# Altium schematic sheet 0208_TBT_0_MISC_GND.SchDoc
size A3
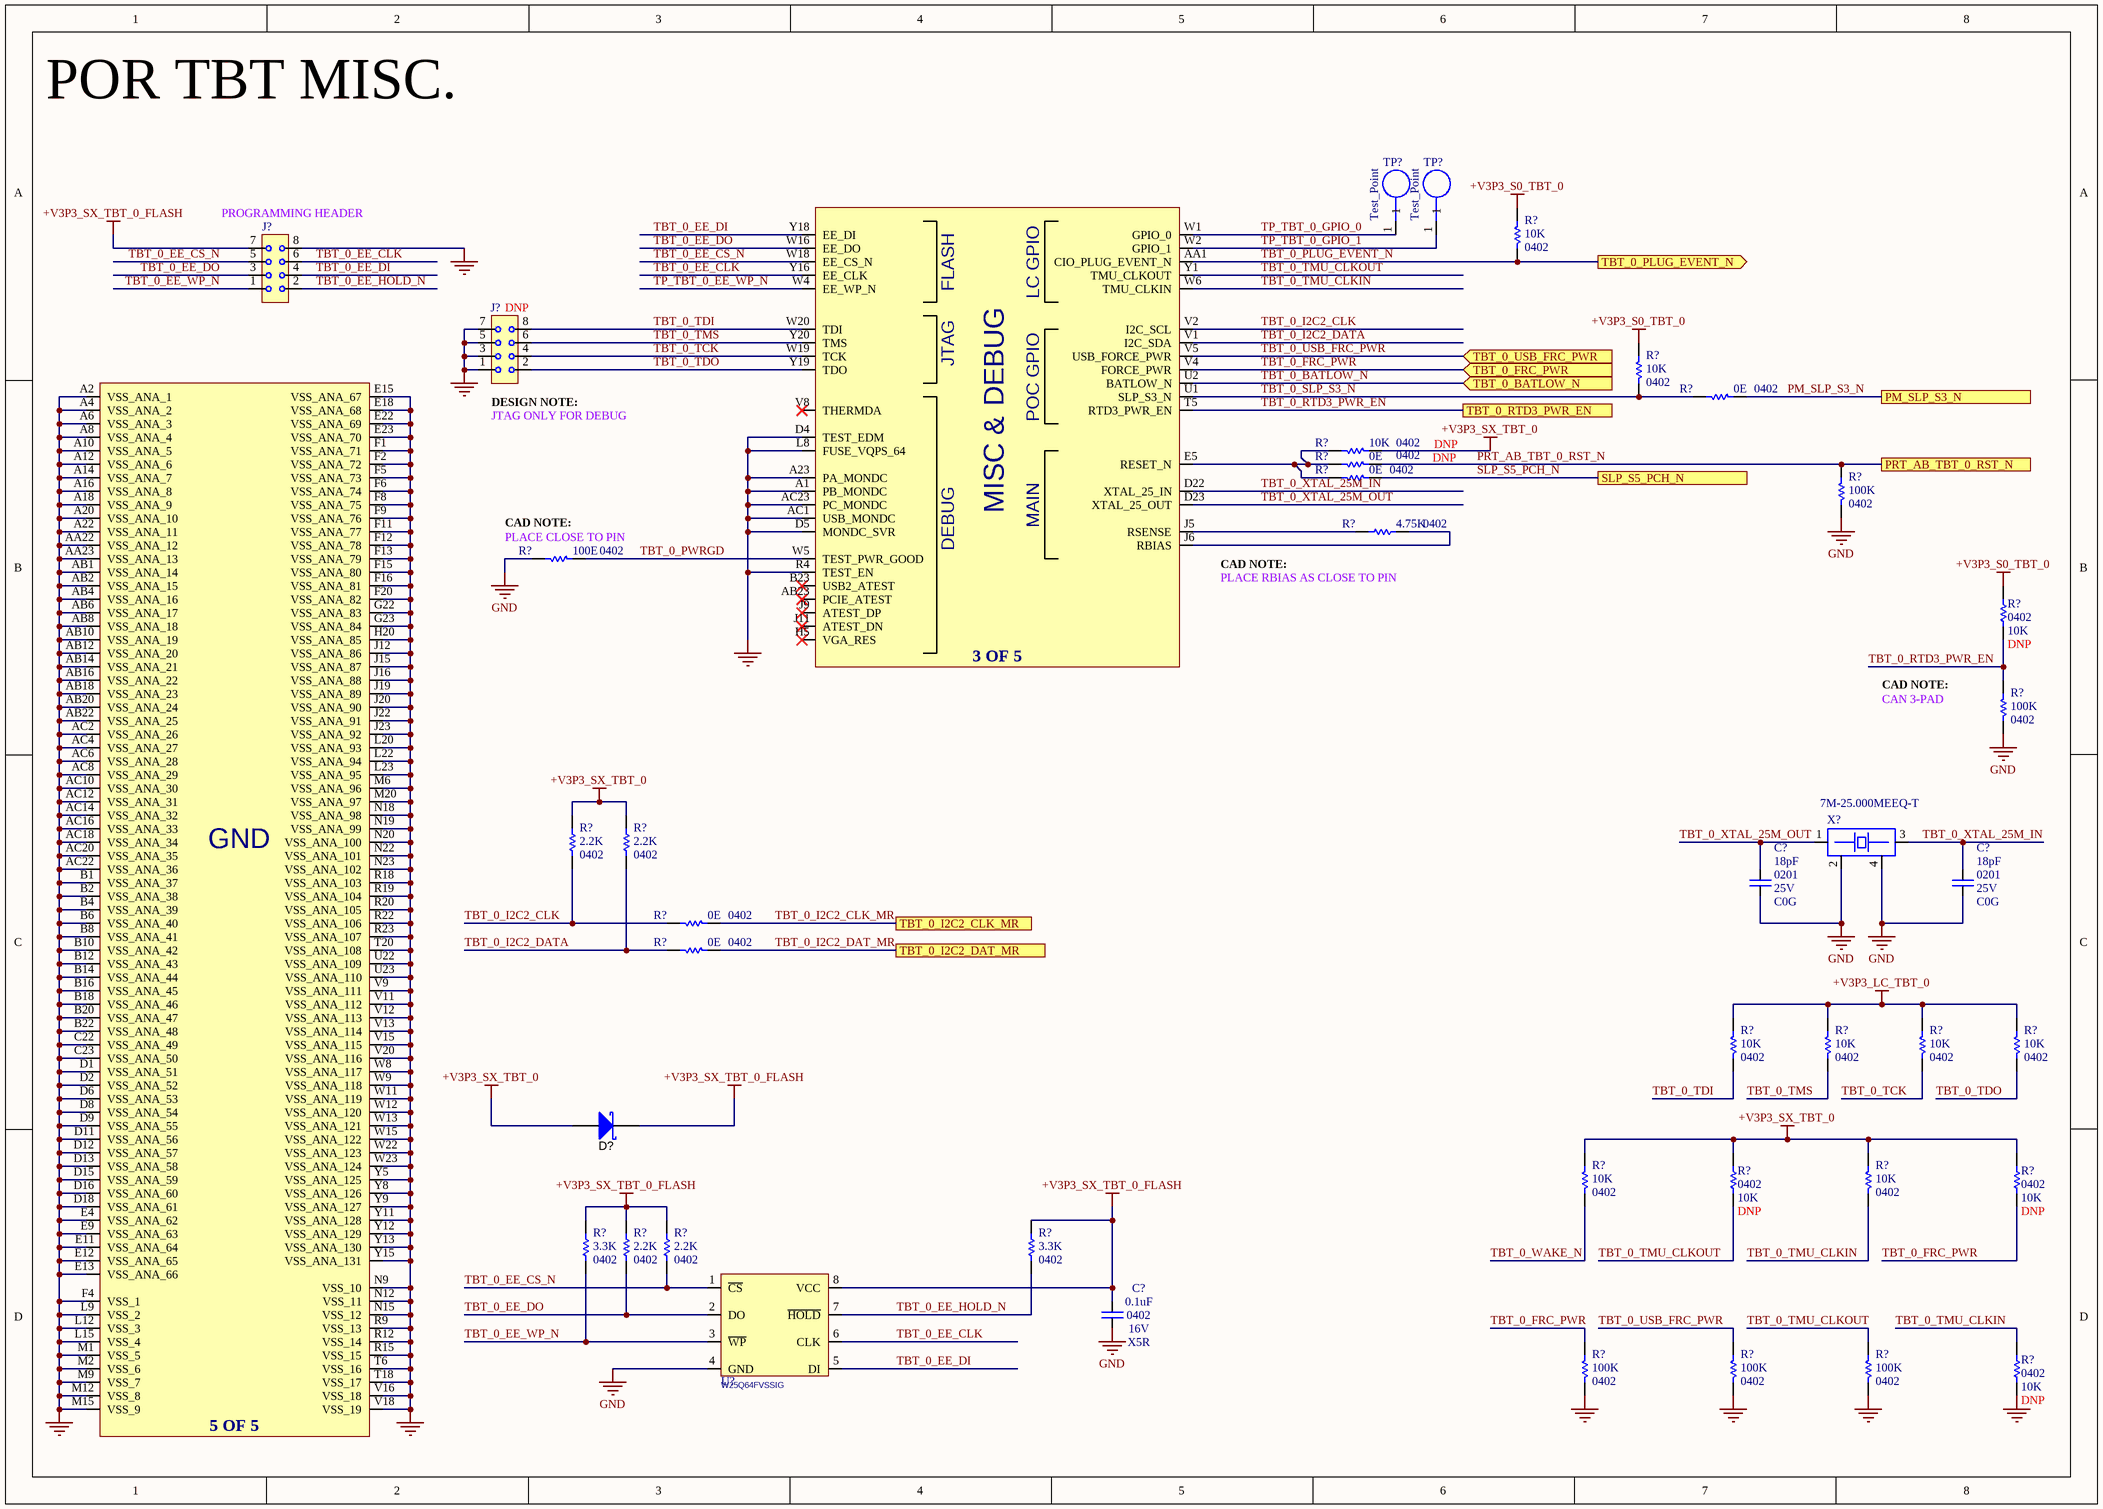
[diagram p0: 0208_TBT_0_MISC_GND.SchDoc]

## Parts
(Parts that share a designator on the sheet are numbered #1, #2 ... from top to bottom, then left to right.)
C?#1  value 18pF  Case/Package: 0201  Voltage: 25V  Dielectric: C0G  [CAPC0201]
C?#2  value 18pF  Case/Package: 0201  Voltage: 25V  Dielectric: C0G  [CAPC0201]
C?#3  value 0.1uF  Case/Package: 0402  Voltage: 16V  Dielectric: X5R  [CAPC0402]
D?  SCHOTTKY  (value not drawn)
J?#1  Header 2x4_1  (value not drawn)
J?#2  Header 2x4_1  (value not drawn)
R?#1  value 10K  Case/Package: 0402  [RESC0402]  (hidden comment: Res)
R?#2  value 10K  Case/Package: 0402  [RESC0402]  (hidden comment: Res)
R?#3  value 0E  Case/Package: 0402  [RESC0402]  (hidden comment: Res)
R?#4  value 10K  Case/Package: 0402  [RESC0402]  (hidden comment: Res)
R?#5  value 0E  Case/Package: 0402  [RESC0402]  (hidden comment: Res)
R?#6  value 0E  Case/Package: 0402  [RESC0402]  (hidden comment: Res)
R?#7  value 100K  Case/Package: 0402  [RESC0402]  (hidden comment: Res)
R?#8  value 4.75K  Case/Package: 0402  [RESC0402]  (hidden comment: Res)
R?#9  value 100E  Case/Package: 0402  [RESC0402]  (hidden comment: Res)
R?#10  value 10K  Case/Package: 0402  [RESC0402]  (hidden comment: Res)
R?#11  value 100K  Case/Package: 0402  [RESC0402]  (hidden comment: Res)
R?#12  value 2.2K  Case/Package: 0402  [RESC0402]  (hidden comment: Res)
R?#13  value 2.2K  Case/Package: 0402  [RESC0402]  (hidden comment: Res)
R?#14  value 0E  Case/Package: 0402  [RESC0402]  (hidden comment: Res)
R?#15  value 0E  Case/Package: 0402  [RESC0402]  (hidden comment: Res)
R?#16  value 10K  Case/Package: 0402  [RESC0402]  (hidden comment: Res)
R?#17  value 10K  Case/Package: 0402  [RESC0402]  (hidden comment: Res)
R?#18  value 10K  Case/Package: 0402  [RESC0402]  (hidden comment: Res)
R?#19  value 10K  Case/Package: 0402  [RESC0402]  (hidden comment: Res)
R?#20  value 10K  Case/Package: 0402  [RESC0402]  (hidden comment: Res)
R?#21  value 10K  Case/Package: 0402  [RESC0402]  (hidden comment: Res)
R?#22  value 10K  Case/Package: 0402  [RESC0402]  (hidden comment: Res)
R?#23  value 10K  Case/Package: 0402  [RESC0402]  (hidden comment: Res)
R?#24  value 3.3K  Case/Package: 0402  [RESC0402]  (hidden comment: Res)
R?#25  value 2.2K  Case/Package: 0402  [RESC0402]  (hidden comment: Res)
R?#26  value 2.2K  Case/Package: 0402  [RESC0402]  (hidden comment: Res)
R?#27  value 3.3K  Case/Package: 0402  [RESC0402]  (hidden comment: Res)
R?#28  value 100K  Case/Package: 0402  [RESC0402]  (hidden comment: Res)
R?#29  value 100K  Case/Package: 0402  [RESC0402]  (hidden comment: Res)
R?#30  value 100K  Case/Package: 0402  [RESC0402]  (hidden comment: Res)
R?#31  value 10K  Case/Package: 0402  [RESC0402]  (hidden comment: Res)
TP?#1  Test_Point  [Test_smd]  (no BOM)
TP?#2  Test_Point  [Test_smd]  (no BOM)
U5A2  C_MAPLE_RIDGE_DP  (value not drawn)  (parts C,E of 5)
U?  W25Q64FVSSIG  [soic127p742-8]
X?  Manufacturer Part Number: 7M-25.000MEEQ-T  [XTAL_432-00011]  (hidden comment: CRYSTAL (7M-25.000MEEQ-T))

## Ports
PM_SLP_S3_N, PRT_AB_TBT_0_RST_N, SLP_S5_PCH_N, TBT_0_BATLOW_N (in), TBT_0_FRC_PWR (in), TBT_0_I2C2_CLK_MR, TBT_0_I2C2_DAT_MR, TBT_0_PLUG_EVENT_N (out), TBT_0_RTD3_PWR_EN, TBT_0_USB_FRC_PWR (in)

## Nets
+V3P3_LC_TBT_0: R?#16.2 R?#17.2 R?#18.2 R?#19.2
+V3P3_S0_TBT_0: R?#1.2 R?#2.2 R?#10.2
+V3P3_SX_TBT_0: D?.A R?#4.2 R?#12.2 R?#13.2 R?#20.2 R?#21.2 R?#22.2 R?#23.2
+V3P3_SX_TBT_0_FLASH: C?#3.2 D?.K J?#1.7 R?#24.2 R?#25.2 R?#26.2 R?#27.2 U?.8(VCC)
FUSE_VQPS_64: U5A2.L8(FUSE_VQPS_64)
GND: C?#1.2 C?#2.2 C?#3.1 J?#1.8 J?#2.1 J?#2.3 J?#2.5 J?#2.7 R?#7.1 R?#9.1 R?#11.1 R?#28.1 R?#29.1 R?#30.1 R?#31.1 U5A2.A1(PB_MONDC) U5A2.A2(VSS_ANA_1) U5A2.A4(VSS_ANA_2) U5A2.A6(VSS_ANA_3) U5A2.A8(VSS_ANA_4) U5A2.A10(VSS_ANA_5) U5A2.A12(VSS_ANA_6) U5A2.A14(VSS_ANA_7) U5A2.A16(VSS_ANA_8) U5A2.A18(VSS_ANA_9) U5A2.A20(VSS_ANA_10) U5A2.A22(VSS_ANA_11) U5A2.A23(PA_MONDC) U5A2.AA22(VSS_ANA_12) U5A2.AA23(VSS_ANA_13) U5A2.AB1(VSS_ANA_14) U5A2.AB2(VSS_ANA_15) U5A2.AB4(VSS_ANA_16) U5A2.AB6(VSS_ANA_17) U5A2.AB8(VSS_ANA_18) U5A2.AB10(VSS_ANA_19) U5A2.AB12(VSS_ANA_20) U5A2.AB14(VSS_ANA_21) U5A2.AB16(VSS_ANA_22) U5A2.AB18(VSS_ANA_23) U5A2.AB20(VSS_ANA_24) U5A2.AB22(VSS_ANA_25) U5A2.AC1(USB_MONDC) U5A2.AC2(VSS_ANA_26) U5A2.AC4(VSS_ANA_27) U5A2.AC6(VSS_ANA_28) U5A2.AC8(VSS_ANA_29) U5A2.AC10(VSS_ANA_30) U5A2.AC12(VSS_ANA_31) U5A2.AC14(VSS_ANA_32) U5A2.AC16(VSS_ANA_33) U5A2.AC18(VSS_ANA_34) U5A2.AC20(VSS_ANA_35) U5A2.AC22(VSS_ANA_36) U5A2.AC23(PC_MONDC) U5A2.B1(VSS_ANA_37) U5A2.B2(VSS_ANA_38) U5A2.B4(VSS_ANA_39) U5A2.B6(VSS_ANA_40) U5A2.B8(VSS_ANA_41) U5A2.B10(VSS_ANA_42) U5A2.B12(VSS_ANA_43) U5A2.B14(VSS_ANA_44) U5A2.B16(VSS_ANA_45) U5A2.B18(VSS_ANA_46) U5A2.B20(VSS_ANA_47) U5A2.B22(VSS_ANA_48) U5A2.C22(VSS_ANA_49) U5A2.C23(VSS_ANA_50) U5A2.D1(VSS_ANA_51) U5A2.D2(VSS_ANA_52) U5A2.D4(TEST_EDM) U5A2.D5(MONDC_SVR) U5A2.D6(VSS_ANA_53) U5A2.D8(VSS_ANA_54) U5A2.D9(VSS_ANA_55) U5A2.D11(VSS_ANA_56) U5A2.D12(VSS_ANA_57) U5A2.D13(VSS_ANA_58) U5A2.D15(VSS_ANA_59) U5A2.D16(VSS_ANA_60) U5A2.D18(VSS_ANA_61) U5A2.E4(VSS_ANA_62) U5A2.E9(VSS_ANA_63) U5A2.E11(VSS_ANA_64) U5A2.E12(VSS_ANA_65) U5A2.E13(VSS_ANA_66) U5A2.E15(VSS_ANA_67) U5A2.E18(VSS_ANA_68) U5A2.E22(VSS_ANA_69) U5A2.E23(VSS_ANA_70) U5A2.F1(VSS_ANA_71) U5A2.F2(VSS_ANA_72) U5A2.F4(VSS_1) U5A2.F5(VSS_ANA_73) U5A2.F6(VSS_ANA_74) U5A2.F8(VSS_ANA_75) U5A2.F9(VSS_ANA_76) U5A2.F11(VSS_ANA_77) U5A2.F12(VSS_ANA_78) U5A2.F13(VSS_ANA_79) U5A2.F15(VSS_ANA_80) U5A2.F16(VSS_ANA_81) U5A2.F20(VSS_ANA_82) U5A2.G22(VSS_ANA_83) U5A2.G23(VSS_ANA_84) U5A2.H20(VSS_ANA_85) U5A2.J12(VSS_ANA_86) U5A2.J15(VSS_ANA_87) U5A2.J16(VSS_ANA_88) U5A2.J19(VSS_ANA_89) U5A2.J20(VSS_ANA_90) U5A2.J22(VSS_ANA_91) U5A2.J23(VSS_ANA_92) U5A2.L8(FUSE_VQPS_64) U5A2.L9(VSS_2) U5A2.L12(VSS_3) U5A2.L15(VSS_4) U5A2.L20(VSS_ANA_93) U5A2.L22(VSS_ANA_94) U5A2.L23(VSS_ANA_95) U5A2.M1(VSS_5) U5A2.M2(VSS_6) U5A2.M6(VSS_ANA_96) U5A2.M9(VSS_7) U5A2.M12(VSS_8) U5A2.M15(VSS_9) U5A2.M20(VSS_ANA_97) U5A2.N9(VSS_10) U5A2.N12(VSS_11) U5A2.N15(VSS_12) U5A2.N18(VSS_ANA_98) U5A2.N19(VSS_ANA_99) U5A2.N20(VSS_ANA_100) U5A2.N22(VSS_ANA_101) U5A2.N23(VSS_ANA_102) U5A2.R4(TEST_EN) U5A2.R9(VSS_13) U5A2.R12(VSS_14) U5A2.R15(VSS_15) U5A2.R18(VSS_ANA_103) U5A2.R19(VSS_ANA_104) U5A2.R20(VSS_ANA_105) U5A2.R22(VSS_ANA_106) U5A2.R23(VSS_ANA_107) U5A2.T6(VSS_16) U5A2.T18(VSS_17) U5A2.T20(VSS_ANA_108) U5A2.U22(VSS_ANA_109) U5A2.U23(VSS_ANA_110) U5A2.V9(VSS_ANA_111) U5A2.V11(VSS_ANA_112) U5A2.V12(VSS_ANA_113) U5A2.V13(VSS_ANA_114) U5A2.V15(VSS_ANA_115) U5A2.V16(VSS_18) U5A2.V18(VSS_19) U5A2.V20(VSS_ANA_116) U5A2.W8(VSS_ANA_117) U5A2.W9(VSS_ANA_118) U5A2.W11(VSS_ANA_119) U5A2.W12(VSS_ANA_120) U5A2.W13(VSS_ANA_121) U5A2.W15(VSS_ANA_122) U5A2.W22(VSS_ANA_123) U5A2.W23(VSS_ANA_124) U5A2.Y5(VSS_ANA_125) U5A2.Y8(VSS_ANA_126) U5A2.Y9(VSS_ANA_127) U5A2.Y11(VSS_ANA_128) U5A2.Y12(VSS_ANA_129) U5A2.Y13(VSS_ANA_130) U5A2.Y15(VSS_ANA_131) U?.4(GND) X?.2 X?.4
PM_SLP_S3_N: R?#3.2 ; port PM_SLP_S3_N
PRT_AB_TBT_0_RST_N: R?#5.2 R?#7.2 ; port PRT_AB_TBT_0_RST_N
SLP_S5_PCH_N: R?#6.2 ; port SLP_S5_PCH_N
TBT_0_BATLOW_N: U5A2.U2(BATLOW_N) ; port TBT_0_BATLOW_N
TBT_0_EE_CLK: J?#1.6 U5A2.Y16(EE_CLK) U?.6(CLK)
TBT_0_EE_CS_N: J?#1.5 R?#26.1 U5A2.W18(EE_CS_N) U?.1(~{CS})
TBT_0_EE_DI: J?#1.4 U5A2.Y18(EE_DI) U?.5(DI)
TBT_0_EE_DO: J?#1.3 R?#25.1 U5A2.W16(EE_DO) U?.2(DO)
TBT_0_EE_HOLD_N: J?#1.2 R?#27.1 U?.7(~{HOLD})
TBT_0_EE_WP_N: J?#1.1 R?#24.1 U?.3(~{WP})
TBT_0_FRC_PWR: R?#23.1 R?#28.2 U5A2.V4(FORCE_PWR) ; port TBT_0_FRC_PWR
TBT_0_I2C2_CLK: R?#12.1 R?#14.1 U5A2.V2(I2C_SCL)
TBT_0_I2C2_CLK_MR: R?#14.2 ; port TBT_0_I2C2_CLK_MR
TBT_0_I2C2_DAT_MR: R?#15.2 ; port TBT_0_I2C2_DAT_MR
TBT_0_I2C2_DATA: R?#13.1 R?#15.1 U5A2.V1(I2C_SDA)
TBT_0_PLUG_EVENT_N: R?#1.1 U5A2.AA1(CIO_PLUG_EVENT_N) ; port TBT_0_PLUG_EVENT_N
TBT_0_PWRGD: R?#9.2 U5A2.W5(TEST_PWR_GOOD)
TBT_0_RTD3_PWR_EN: R?#10.1 R?#11.2 U5A2.T5(RTD3_PWR_EN) ; port TBT_0_RTD3_PWR_EN
TBT_0_SLP_S3_N: R?#2.1 R?#3.1 U5A2.U1(SLP_S3_N)
TBT_0_TCK: J?#2.4 R?#18.1 U5A2.W19(TCK)
TBT_0_TDI: J?#2.8 R?#16.1 U5A2.W20(TDI)
TBT_0_TDO: J?#2.2 R?#19.1 U5A2.Y19(TDO)
TBT_0_TMS: J?#2.6 R?#17.1 U5A2.Y20(TMS)
TBT_0_TMU_CLKIN: R?#22.1 R?#31.2 U5A2.W6(TMU_CLKIN)
TBT_0_TMU_CLKOUT: R?#21.1 R?#30.2 U5A2.Y1(TMU_CLKOUT)
TBT_0_USB_FRC_PWR: R?#29.2 U5A2.V5(USB_FORCE_PWR) ; port TBT_0_USB_FRC_PWR
TBT_0_WAKE_N: R?#20.1
TBT_0_XTAL_25M_IN: C?#2.1 U5A2.D22(XTAL_25_IN) X?.3
TBT_0_XTAL_25M_OUT: C?#1.1 U5A2.D23(XTAL_25_OUT) X?.1
TP_TBT_0_EE_WP_N: U5A2.W4(EE_WP_N)
TP_TBT_0_GPIO_0: TP?#1.1 U5A2.W1(GPIO_0)
TP_TBT_0_GPIO_1: TP?#2.1 U5A2.W2(GPIO_1)
NetR?#4_1: R?#4.1 R?#5.1 R?#6.1 U5A2.E5(RESET_N)
NetR?#8_1: R?#8.1 U5A2.J6(RBIAS)
NetR?#8_2: R?#8.2 U5A2.J5(RSENSE)

Not connected (* = marked no-connect by the designer): U5A2 AB23(PCIE_ATEST)* B23(USB2_ATEST)* H5(VGA_RES)* J9(ATEST_DP)* J11(ATEST_DN)* V8(THERMDA)*

## Notes on the sheet
- POR TBT MISC.
- (near J?#1) PROGRAMMING HEADER
- (near J?#2) DESIGN NOTE:
- (near J?#2) JTAG ONLY FOR DEBUG
- (near R?#9) CAD NOTE:
- (near R?#9) PLACE CLOSE TO PIN
- (near U5A2) CAD NOTE:
- PLACE RBIAS AS CLOSE TO PIN
- CAD NOTE:
- CAN 3-PAD
- (in symbol C_MAPLE_RIDGE_DP, part C) FLASH; LC GPIO; JTAG; DEBUG; POC GPIO; MISC &; MAIN; 3 OF 5
- (in symbol C_MAPLE_RIDGE_DP, part E) GND; 5 OF 5

## Library data of the parts
C?#1 C?#2 = Cap: CAP CER 18pF 25V C0G 0201
C?#3 = Cap: CAP CER 0.1uF 16V X5R 0402
D? = SCHOTTKY: Diode, Schottky, 40V, 5A, SMC; ComponentLink1Description: Datasheet link; ComponentLink1URL: http://www.comchip.com.tw/cms/UserFiles/QW-BB012%20CDBC520-G%7E5100-G%20RevC809622.pdf; Manufacturer Part Number: *; Case/Package: *
J?#1 J?#2 = Header 2x4_1: Header 2x4 2.54mm
  J?#2: DNP: DNP
R?#1 R?#2 R?#10 R?#16-R?#23 R?#31 = Res: Thick Film Resistor -  10Kohm, 1%, 0402
  R?#10 R?#21 R?#23 R?#31: DNP: DNP
R?#3 R?#5 R?#6 R?#14 R?#15 = Res: Thick Film Resistor -  0ohm, 1%, 0402
  R?#5: DNP: DNP
R?#4 = Res: Thick Film Resistor -  10K, 1%, 0402; DNP: DNP
R?#7 R?#11 R?#28-R?#30 = Res: Thick Film Resistor -  100Kohm, 1%, 0402
R?#8 = Res: Thick Film Resistor -  4.75Kohm, 1%, 0402
R?#9 = Res: Thick Film Resistor -  100ohm, 1%, 0402
R?#12 R?#13 R?#25 R?#26 = Res: Thick Film Resistor -  2.2Kohm, 1%, 0402
R?#24 R?#27 = Res: Thick Film Resistor -  3.3Kohm, 1%, 0402
U? = TMP_134204: Flash, Serial, 64Mbit, 2.7 - 3.6V, SPI, SO8; Device: 473-00015
X? = CRYSTAL (7M-25.000MEEQ-T): 25MHz ±10ppm Crystal 10pF 60 Ohms 4-SMD, No Lead; Case/Package: SMD/SMT; ComponentLink1URL: https://www.verical.com/server-webapp/html/getDatasheet?partID=757227&src-supplier=Verical; ComponentLink1Description: https://www.verical.com/server-webapp/html/getDatasheet?partID=757227&src-supplier=Verical; ComponentLink2URL: http://www.txccrystal.com/images/pdf/7m-accuracy.pdf?src-supplier=Digi-Key; ComponentLink2Description: http://www.txccrystal.com/images/pdf/7m-accuracy.pdf?src-supplier=Digi-Key; ComponentLink3URL: http://www.farnell.com/datasheets/1794111.pdf?src-supplier=Element14; ComponentLink3Description: http://www.farnell.com/datasheets/1794111.pdf?src-supplier=Element14; ComponentLink4URL: http://www.mouser.com/ds/2/417/7m-11184.pdf?src-supplier=Mouser; ComponentLink4Description: http://www.mouser.com/ds/2/417/7m-11184.pdf?src-supplier=Mouser
U5A2 = C_MAPLE_RIDGE_DP: Case/Package: *; Manufacturer Part Number: *